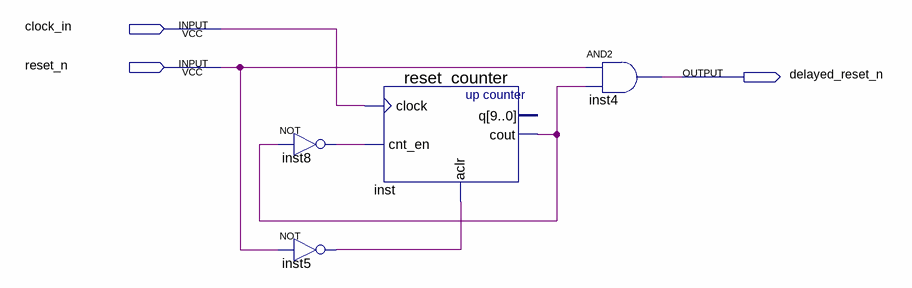
[diagram p0: schematic sheet]
// Quartus schematic delay_reset_block.bdf as structural Verilog: 4 symbols, 3 pins
module delay_reset_block (
  input  clock_in,
  input  reset_n,
  output delayed_reset_n
);

  wire inst5_out, inst8_out, inst_cout;

  not inst8 (inst8_out, inst_cout);
  not inst5 (inst5_out, reset_n);
  reset_counter inst (.clock(clock_in), .cnt_en(inst8_out), .aclr(inst5_out), .cout(inst_cout));  // open: q
  and inst4 (delayed_reset_n, reset_n, inst_cout);
endmodule
